# Altium schematic sheet Pullup.SchDoc
size A4
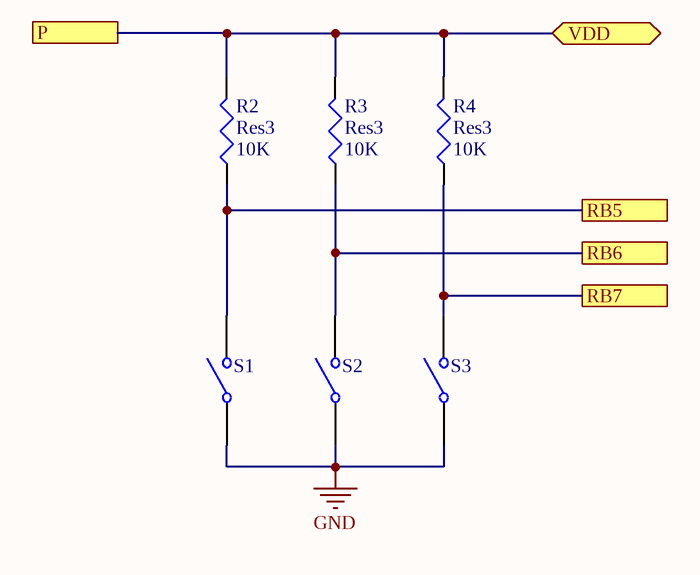
[diagram p0: Pullup.SchDoc]

## Parts
R2  Res3  value 10K  [J1-0603]
R3  Res3  value 10K  [J1-0603]
R4  Res3  value 10K  [J1-0603]
S1  SW-SPST  [SPST-2]  (value not drawn)
S2  SW-SPST  [SPST-2]  (value not drawn)
S3  SW-SPST  [SPST-2]  (value not drawn)

## Ports
P, RB5, RB6, RB7, VDD

## Nets
GND: S1.1(COMMON) S2.1(COMMON) S3.1(COMMON)
P: R2.2 R3.2 R4.2 ; port P, port VDD
RB5: R2.1 S1.2(NO) ; port RB5
RB6: R3.1 S2.2(NO) ; port RB6
RB7: R4.1 S3.2(NO) ; port RB7

## Library data of the parts
R2-R4 = Res3: Resistor; Published: 8-Jun-2000; LatestRevisionDate: 29-May-2009; LatestRevisionNote: IPC-7351 Footprint Added.; PackageReference: J1-0603; Publisher: Altium Limited; PackageDescription: Chip Resistor
S1-S3 = SW-SPST: Single-Pole, Single-Throw Switch; Published: 24-Mar-1999; LatestRevisionDate: 17-Jul-2002; LatestRevisionNote: Re-released for DXP Platform.; PackageReference: SPST-2; Publisher: Altium Limited; PackageDescription: Switch; 2 Leads